# Altium schematic sheet Pulser.SchDoc: Jim Williams Pulse Generator
size A4; Revision: 2.0
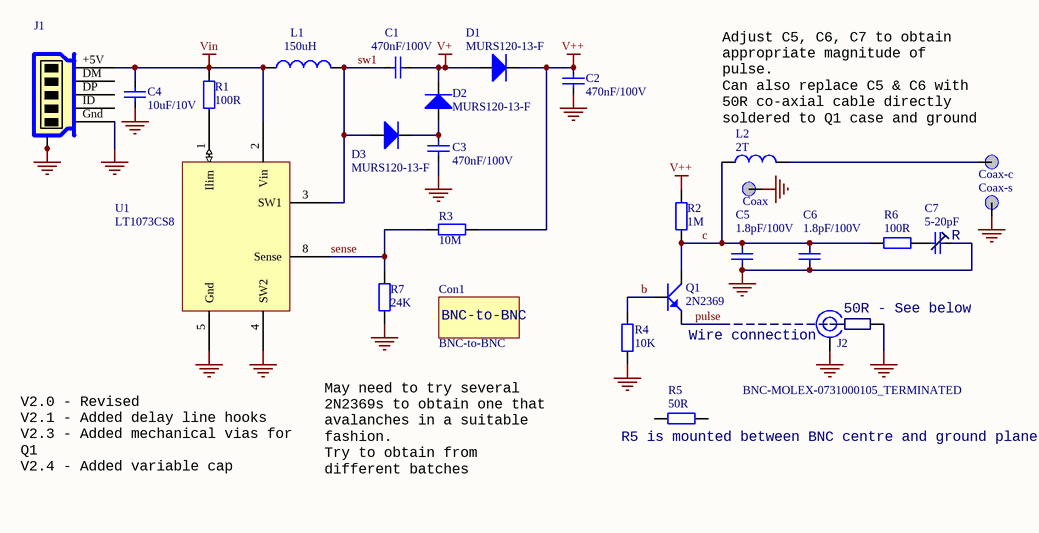
[diagram p0: Pulser.SchDoc]

## Parts
C1  470nF/100V  [CCNP3216-1206]
C2  470nF/100V  [CCNP3216-1206]
C3  470nF/100V  [CCNP3216-1206]
C4  10uF/10V  [CCNP2012-0805]
C5  1.8pF/100V  [CCNP2012-0805]
C6  1.8pF/100V  [CCNP2012-0805]
C7  5-20pF  [CAP_TRIM_SMT_TZC3]
Coax  PAD  [Pad]  (value not drawn)  (no BOM)
Coax-c  PAD  [Pad]  (value not drawn)  (no BOM)
Coax-s  PAD  [Pad]  (value not drawn)  (no BOM)
Con1  BNC-to-BNC  [BNC-to-BNC]  (mechanical)
D1  MURS120-13-F  [SMB_Diode]
D2  MURS120-13-F  [SMB_Diode]
D3  MURS120-13-F  [SMB_Diode]
J1  USB_MICRO_B_CONNECTOR  [MOLEX - 47346-0001]  (value not drawn)
J2  BNC-MOLEX-0731000105_TERMINATED  [BNC_RA CON - Molex - Resistor]
L1  150uH  [INDUCTOR_SMT]
L2  2T  [CL2012-0805]
Q1  2N2369  [TO-18-flush]
R1  100R  [CR2012-0805]
R2  1M  [CR2012-0805]
R3  10M  [CR2012-0805]
R4  10K  [CR2012-0805]
R5  50R  [CR3216-1206]  (mechanical)
R6  100R  [CR2012-0805]
R7  24K  [CR2012-0805]
U1  LT1073CS8  [SO-8_L]

## Nets
GND: C2.2 C3.1 C4.2 C5.1 C6.1 C7.R Coax.1 Coax-s.1 J1.G(USBGnd) J1.S1(USBShd) J1.S2(USBShd) J1.S3(USBShd) J1.S4(USBShd) J1.S5(USBShd) J1.S6(USBShd) J2.1 J2.2 R4.1 R7.1 U1.4(SW2) U1.5(Gnd)
V+: C1.2 D1.A D2.K
V++: C2.1 D1.K R2.1 R3.2
Vin: C4.1 J1.VBUS(USB+5v) L1.1 R1.1 U1.2(Vin)
b: Q1.B R4.2
c: C5.2 C6.2 L2.1 Q1.C R2.2 R6.1
pulse: Q1.E
sense: R3.1 R7.2 U1.8(Sense)
sw1: C1.1 D3.A L1.2 U1.3(SW1)
NetC3_2: C3.2 D2.A D3.K
NetC7_S: C7.S R6.2
NetCoax-c_1: Coax-c.1 L2.2
NetR1_2: R1.2 U1.1(Ilim)

Not connected (* = marked no-connect by the designer): J1 D+(USBDP) D-(USBDM) ID(USB_ID); R5 1 2

## Notes on the sheet
- Adjust C5, C6, C7 to obtain appropriate magnitude of pulse.
  Can also replace C5 & C6 with 50R co-axial cable directly soldered to Q1 case and ground plane to extend pulse.
- (near Q1) Wire connection
- (near J2) 50R - See below
- May need to try several  2N2369s to obtain one that avalanches in a suitable fashion.
  Try to obtain from different batches (suppliers)
- (near R5) R5 is mounted between BNC centre and ground plane
- V2.0 - Revised
  V2.1 - Added delay line hooks
  V2.3 - Added mechanical vias for Q1
  V2.4 - Added variable cap
- (in symbol USB_MICRO_B_CONNECTOR) +5V; DM; DP; Gnd

## Library data of the parts
C1-C3 C5 C6 = Cap: Capacitor; Manufacturer: Generic Components; Class: Passive; Published: 08/06/2000; Publisher: Altium Hobart Technology Centre; SubClass: Capacitor; Digikey: *
  C1-C3: Farnell PN: 2497173; Value: 470nF/100V
  C5 C6: Farnell PN: 2672812; Value: 1.8pF/100V
C4 = Cap_CCNP_0805: Capacitor SMT 0805; Manufacturer: Generic Components; Class: Passive; Published: 08/06/2000; Publisher: Altium Hobart Technology Centre; SubClass: Capacitor; Farnell PN: *; Digikey: *; Value: 10uF/10V
C7 = Cap_Trimmer_TZC3: Trimmer Capacitor muRata TZC3 series; Manufacturer: Generic Components; Class: Passive; Published: 08/06/2000; Publisher: Altium Hobart Technology Centre; SubClass: Capacitor; Farnell PN: 9528652; Digikey: *; Value: 5-20pF
D1-D3 = MURS120-13-F: Fast / Ultrafast Diode, 200 V, 1 A; Manufacturer: Generic Components; Class: Discrete; SubClass: Diode - Switching; Published: 08/06/2000; Publisher: Altium Hobart Technology Centre; Digikey: *; Farnell PN: 1858618
J1 = USB_MICRO_B_CONNECTOR: USB Micro-B Connector; Farnell PN: 1568026; Digikey: *
J2 = BNC-MOLEX-0731000105_TERMINATED: BNC Connector; Digikey: WM5524-ND; Farnell PN: 1418237
L1 = INDUCTOR-SMT: Inductor - SMT 3mm; Digikey: *; Farnell PN: 1864148; Value: 150uH
L2 = Ind_CL0805: Resistor; Manufacturer: Generic Components; Class: Passive; Published: 08/06/2000; Publisher: Altium Hobart Technology Centre; SubClass: Resistor; Farnell PN: *; Digikey: *; Value: 2T
Q1 = 2N2369: High Speed Switching Transistor; Digikey: *; Farnell PN: 9206850
R1-R7 = Res: Resistor; Manufacturer: Generic Components; Class: Passive; Published: 08/06/2000; Publisher: Altium Hobart Technology Centre; SubClass: Resistor; Farnell PN: *; Digikey: *
  R1 R6: Value: 100R
  R2: Value: 1M
  R3: Value: 10M
  R4: Value: 10K
  R5: Value: 50R
  R7: Value: 24K
U1 = LT1073CS8: Micropower DC/DC Converter (Adjustable, 212mV reference); Farnell PN: 1273663
Coax Coax-c Coax-s = PAD: Digikey: *; Farnell PN: *
Con1 = BNC-to-BNC: Farnell PN: 4195255